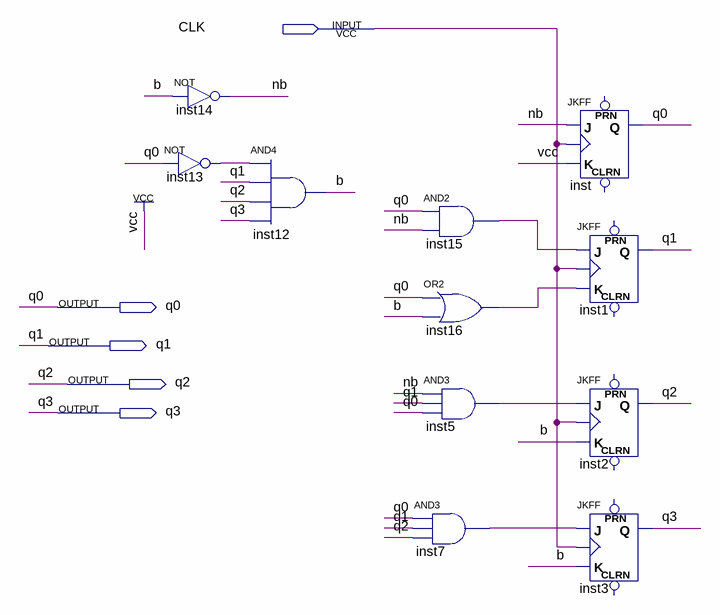
[diagram p0: schematic sheet]
// Quartus schematic lab4.bdf as structural Verilog: 11 symbols, 5 pins
module lab4 (
  input  CLK,
  output q0,
  output q1,
  output q2,
  output q3
);

  wire b, inst5_out, inst7_out, inst13_out, inst15_out, inst16_out, nb;

  not inst13 (inst13_out, q0);
  not inst14 (nb, b);
  and inst12 (b, inst13_out, q1, q2, q3);
  and inst15 (inst15_out, q0, nb);
  or inst16 (inst16_out, q0, b);
  and inst5 (inst5_out, nb, q1, q0);
  and inst7 (inst7_out, q0, q1, q2);
  JKFF inst (.K(1'b1), .J(nb), .CLK(CLK), .Q(q0));  // open: PRN, CLRN
  JKFF inst1 (.K(inst16_out), .J(inst15_out), .CLK(CLK), .Q(q1));  // open: PRN, CLRN
  JKFF inst2 (.K(b), .J(inst5_out), .CLK(CLK), .Q(q2));  // open: PRN, CLRN
  JKFF inst3 (.K(b), .J(inst7_out), .CLK(CLK), .Q(q3));  // open: PRN, CLRN
endmodule
